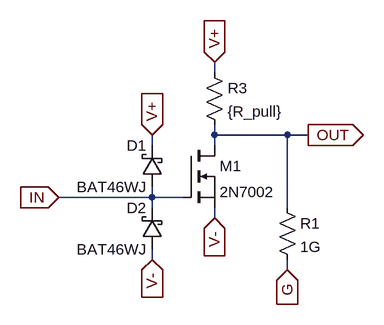
[diagram p0: schematic tri_sel0.asc]
tri_sel0.asc, the LTspice schematic file:
Version 4
SHEET 1 880 680
WIRE 32 16 32 0
WIRE 32 112 32 96
WIRE 144 112 32 112
WIRE 176 112 144 112
WIRE -64 128 -64 112
WIRE 32 128 32 112
WIRE -64 208 -64 192
WIRE -64 208 -208 208
WIRE -16 208 -64 208
WIRE -64 224 -64 208
WIRE 144 224 144 112
WIRE 32 240 32 224
WIRE -64 304 -64 288
WIRE 144 320 144 304
FLAG -64 112 V+
IOPIN -64 112 In
FLAG -64 304 V-
IOPIN -64 304 In
FLAG -208 208 IN
IOPIN -208 208 In
FLAG 176 112 OUT
IOPIN 176 112 Out
FLAG 32 0 V+
IOPIN 32 0 In
FLAG 32 240 V-
IOPIN 32 240 In
FLAG 144 320 G
IOPIN 144 320 In
SYMBOL nmos -16 128 R0
SYMATTR InstName M1
SYMATTR Value 2N7002
SYMBOL schottky -48 192 R180
WINDOW 0 24 64 Left 2
WINDOW 3 24 0 Left 2
SYMATTR InstName D1
SYMATTR Value BAT46WJ
SYMATTR Description Diode
SYMATTR Type diode
SYMBOL schottky -48 288 R180
WINDOW 0 24 64 Left 2
WINDOW 3 24 0 Left 2
SYMATTR InstName D2
SYMATTR Value BAT46WJ
SYMATTR Description Diode
SYMATTR Type diode
SYMBOL res 16 0 R0
SYMATTR InstName R3
SYMATTR Value {R_pull}
SYMBOL res 128 208 R0
SYMATTR InstName R1
SYMATTR Value 1G

The netlist it stands for:
* tri_sel0.asc
M1 OUT IN V- V- 2N7002
D1 IN V+ BAT46WJ
D2 V- IN BAT46WJ
R3 V+ OUT {R_pull}
R1 OUT G 1G
.model D D
.lib standard.dio
.model NMOS NMOS
.model PMOS PMOS
.lib standard.mos
.backanno
.end